# Altium schematic sheet LedBlinker.SchDoc: LED Blinker
size Letter; PageSetup: Record=PageOptions|CenterHorizontal=True|CenterVertical=True|PrintScale=0.98|XCorrection=1.00|YCorrection=1.00|PrintKind=1|BorderSize=5000000|LeftOffset=0|BottomOffset=0|Orientation=2|PaperLength=1000|PaperWidth=1000|Scale=100|PaperSource=15|PrintQuality=600|MediaType=1|DitherType=10|PaperKind=Letter|PrintScaleMode=1; Organization: Engenuics Technologies Inc; DocumentNumber: LedBlinker; Revision: 01; SheetNumber: 1; SheetTotal: 1
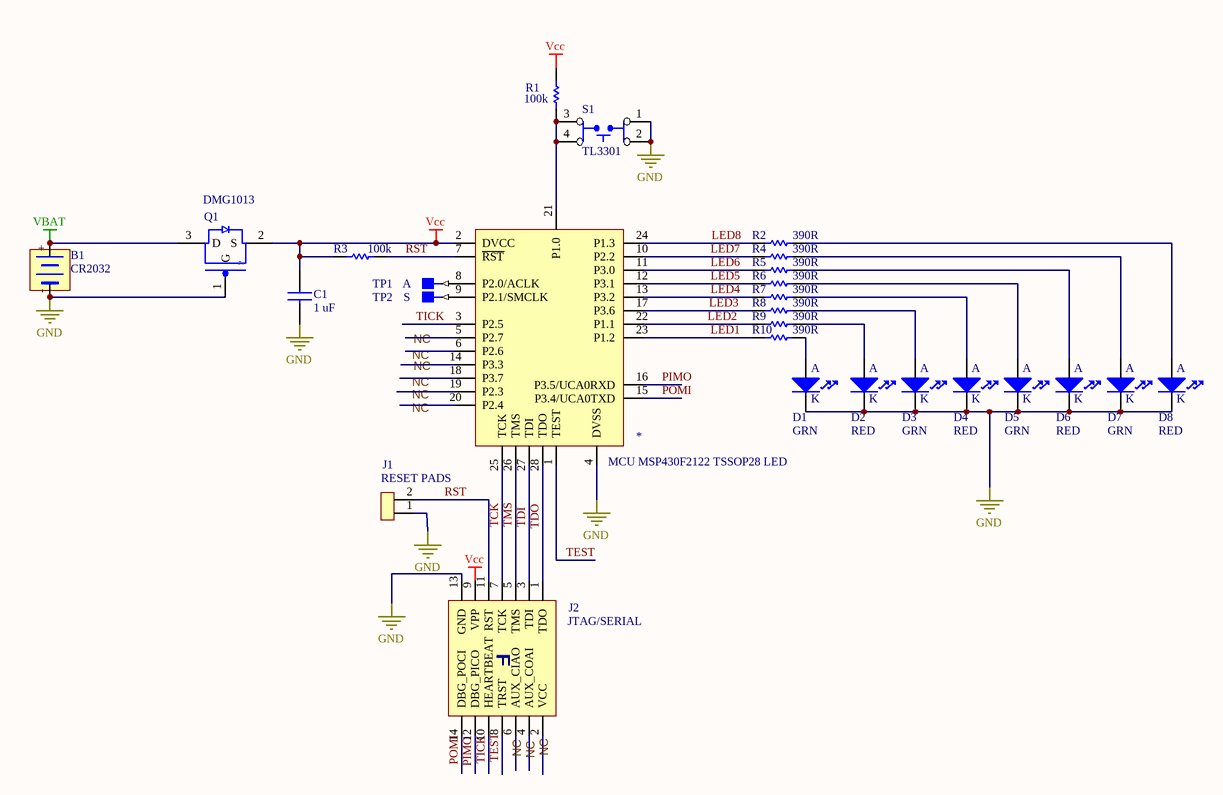
[diagram p0: LedBlinker.SchDoc]

## Parts
*  MCU MSP430F2122 TSSOP28 LED
B1  CR2032  [CONN BATTERY HOLDER CR2032]
C1  1 uF  [0603]
D1  GRN  [PLCC-2 AK]
D2  RED  [PLCC-2 AK]
D3  GRN  [PLCC-2 AK]
D4  RED  [PLCC-2 AK]
D5  GRN  [PLCC-2 AK]
D6  RED  [PLCC-2 AK]
D7  GRN  [PLCC-2 AK]
D8  RED  [PLCC-2 AK]
J1  RESET PADS  [HDR1X2]
J2  JTAG/SERIAL  [CONN 14POS 7X2 SMT FEMALE SMALL]
Q1  DMG1013  [SC-70-3]
R1  100k  [0603]
R2  390R  [0603]
R3  100k  [0603]
R4  390R  [0603]
R5  390R  [0603]
R6  390R  [0603]
R7  390R  [0603]
R8  390R  [0603]
R9  390R  [0603]
R10  390R  [0603]
S1  TL3301  [SWITCH TACT SMT TL3301 J LEAD]
TP1  A  [TEST POINT SMT]  (no BOM)
TP2  S  [TEST POINT SMT]  (no BOM)

## Nets
GND: *.4(DVSS) B1.- C1.2 D1.K D2.K D3.K D4.K D5.K D6.K D7.K D8.K J1.1 J2.13(GND) Q1.1(G) S1.1(X1) S1.2(X2)
VBAT: B1.+ Q1.3(D)
Vcc: *.2(DVCC) C1.1 J2.9(VPP) Q1.2(S) R1.2 R3.1
LED1: *.23(P1.2) R10.1
LED2: *.22(P1.1) R9.1
LED3: *.17(P3.6) R8.1
LED4: *.13(P3.2) R7.1
LED5: *.12(P3.1) R6.1
LED6: *.11(P3.0) R5.1
LED7: *.10(P2.2) R4.1
LED8: *.24(P1.3) R2.1
PIMO: *.16(P3.5/UCA0RXD) J2.12(DBG_PICO)
POMI: *.15(P3.4/UCA0TXD) J2.14(DBG_POCI)
RST: *.7(~{RST}) J1.2 J2.11(RST) R3.2
TCK: *.25(TCK) J2.7(TCK)
TDI: *.27(TDI) J2.3(TDI)
TDO: *.28(TDO) J2.1(TDO)
TEST: *.1(TEST) J2.8(TRST)
TICK: *.3(P2.5) J2.10(HEARTBEAT)
TMS: *.26(TMS) J2.5(TMS)
Net*_8: *.8(P2.0/ACLK) TP1.1
Net*_9: *.9(P2.1/SMCLK) TP2.1
Net*_21: *.21(P1.0) R1.1 S1.3(Y1) S1.4(Y2)
NetD1_A: D1.A R10.2
NetD2_A: D2.A R9.2
NetD3_A: D3.A R8.2
NetD4_A: D4.A R7.2
NetD5_A: D5.A R6.2
NetD6_A: D6.A R5.2
NetD7_A: D7.A R4.2
NetD8_A: D8.A R2.2

Not connected (* = marked no-connect by the designer): * 5(P2.7) 6(P2.6) 14(P3.3) 18(P3.7) 19(P2.3) 20(P2.4); J2 2(VCC) 4(AUX_COAI) 6(AUX_CIAO)

## Notes on the sheet
- NC
- (near *) NC
- (near J2) NC
- Title:
- Number:
- Date:
- Version
- Sheet:
- of
- Author:
- File:
- (in symbol CONN JTAG/SERIAL FEMALE) F
- (in symbol TRANS PMOS 1G 2S 3D) P

## Library data of the parts
B1 = CONN BATTERY HOLDER CR2032: 3V Coincell Battery; 2. Manufacturer: FCI; 3. Manufacturer Part Number: BK-912; 5. Internal Part Number: 100192; 1. Description: CONN HOLDER COIN CELL 20MM SMD; 7. Modified By: JRL; 4. Digi-Key Part Number: BK-912-ND; 6. Last Modified: 2012-09-03
C1 = CAPACITOR NON-POLARIZED: 1. Description: CAP [TYPE] [VALUE] [TOLERANCE] [VOLTAGE] [CLASS] [PACKAGE]; 5. Internal Part Number: *; 4. Digi-Key Part Number: *; 3. Manufacturer Part Number: *; 6. Last Modified: *; 7. Modified By: *; 2. Manufacturer: *
D1-D8 = LED AK: 1. Description: LED [COLOR] [STYLE] [PACKAGE] [MOUNT]; 2. Manufacturer: *; 3. Manufacturer Part Number: *; 4. Digi-Key Part Number: *; 5. Internal Part Number: *; 6. Last Modified: *; 7. Modified By: *
J1 = CONN SIP 2: 2. Manufacturer: *; 3. Manufacturer Part Number: *; 1. Description: *; 4. Digi-Key Part Number: *; 5. Internal Part Number: *; 6. Last Modified: *; 7. Modified By: *
J2 = CONN JTAG/SERIAL FEMALE: 2. Manufacturer: FCI; 3. Manufacturer Part Number: 20021321-00014T4LF; 5. Internal Part Number: 100254; 1. Description: CONN TERMINAL 14POS 7X2 1.27MM VERT SMD; 7. Modified By: AAL; 4. Digi-Key Part Number: 609-3771-ND; 6. Last Modified: 2018-09-29
Q1 = TRANS PMOS 1G 2S 3D: 2. Manufacturer: *; 3. Manufacturer Part Number: *; 4. Digi-Key Part Number: *; 5. Internal Part Number: *; 6. Last Modified: *; 7. Modified By: *
R1-R10 = RESISTOR: 1. Description: RES [VALUE] [POWER] [TOLERANCE] [PACKAGE] [CONSTRUCTION]; 5. Internal Part Number: *; 4. Digi-Key Part Number: *; 2. Manufacturer: *; 3. Manufacturer Part Number: *; 6. Last Modified: *; 7. Modified By: *
S1 = SWITCH SPST TL3301 JLEAD: SPST TACT SWITCH; 2. Manufacturer: E-Switch; 3. Manufacturer Part Number: TL3301xxx; 1. Description: SWITCH TACT 260GF H=5.0MM SMT; 7. Modified By: JRL; 6. Last Modified: 2014-10-24
TP1 TP2 = TEST POINT SMT: 1. Description: Test pad; 7. Modified By: JRL; 2. Manufacturer: N/A; 3. Manufacturer Part Number: N/A; 4. Digi-key Part Number: N/A; 5. Internal Part Number: N/A; 6. Last Modified: June 12, 2008
* = MCU MSP430F2122 TSSOP28 LED: 1. Description: *; 2. Manufacturer: *; 3. Manufacturer Part Number: *; 4. Digi-Key Part Number: *; 5. Internal Part Number: *; 6. Last Modified: *; 7. Modified By: *